# EAGLE design Turnout Decoder V1.2 (EAGLE 8.4.3)
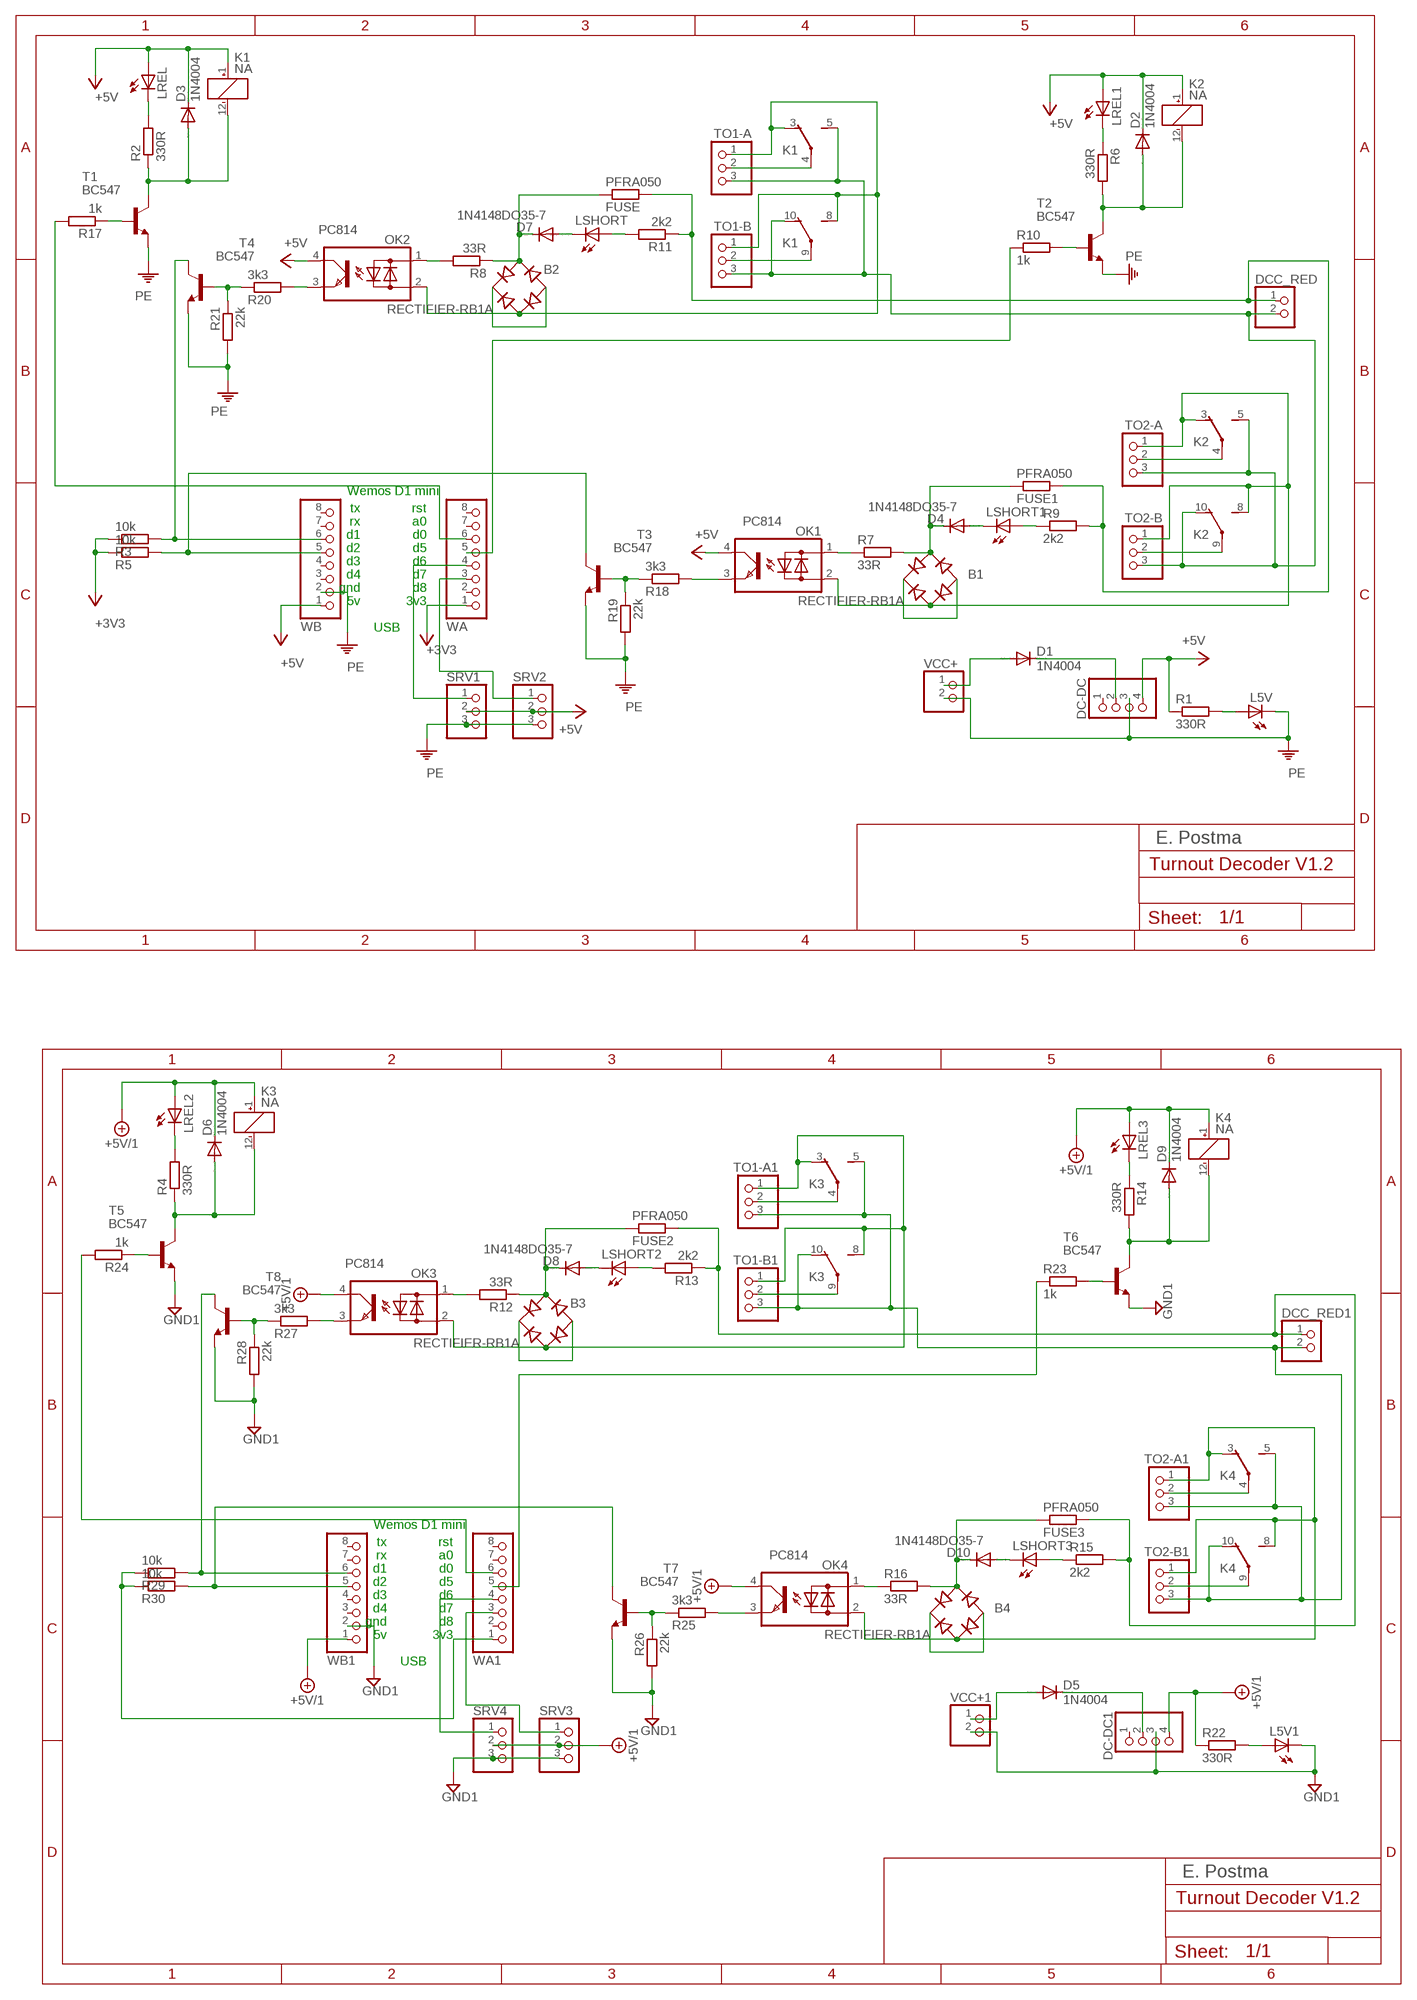
[diagram p0: schematic, sheet 1]

## Parts
B1  RECTIFIER-RB1A  [RB1A]
B2  RECTIFIER-RB1A  [RB1A]
B3  RECTIFIER-RB1A  [RB1A]
B4  RECTIFIER-RB1A  [RB1A]
D1  1N4004  [DO41-10]
D2  1N4004  [DO41-10]
D3  1N4004  [DO41-10]
D4  1N4148DO35-7  [DO35-7]
D5  1N4004  [DO41-10]
D6  1N4004  [DO41-10]
D7  1N4148DO35-7  [DO35-7]
D8  1N4148DO35-7  [DO35-7]
D9  1N4004  [DO41-10]
D10  1N4148DO35-7  [DO35-7]
DC-DC  PINHD-1X4  [1X04]
DC-DC1  PINHD-1X4  [1X04]
DCC_RED  PINHD-1X2  [1X02]
DCC_RED1  PINHD-1X2  [1X02]
FUSE  PFRA050  R-EU_0414/5V  [0414V]
FUSE1  PFRA050  R-EU_0414/5V  [0414V]
FUSE2  PFRA050  R-EU_0414/5V  [0414V]
FUSE3  PFRA050  R-EU_0414/5V  [0414V]
K1  NA  [NA]
K2  NA  [NA]
K3  NA  [NA]
K4  NA  [NA]
L5V  LED3MM  [LED3MM]
L5V1  LED3MM  [LED3MM]
LREL  LED3MM  [LED3MM]
LREL1  LED3MM  [LED3MM]
LREL2  LED3MM  [LED3MM]
LREL3  LED3MM  [LED3MM]
LSHORT  LED3MM  [LED3MM]
LSHORT1  LED3MM  [LED3MM]
LSHORT2  LED3MM  [LED3MM]
LSHORT3  LED3MM  [LED3MM]
OK1  PC814  [DIL04]
OK2  PC814  [DIL04]
OK3  PC814  [DIL04]
OK4  PC814  [DIL04]
R1  330R  R-EU_0207/7  [0207/7]
R2  330R  R-EU_0207/7  [0207/7]
R3  10k  R-EU_0207/7  [0207/7]
R4  330R  R-EU_0207/7  [0207/7]
R5  10k  R-EU_0207/7  [0207/7]
R6  330R  R-EU_0207/7  [0207/7]
R7  33R  R-EU_0207/7  [0207/7]
R8  33R  R-EU_0207/7  [0207/7]
R9  2k2  R-EU_0207/7  [0207/7]
R10  1k  R-EU_0207/7  [0207/7]
R11  2k2  R-EU_0207/7  [0207/7]
R12  33R  R-EU_0207/7  [0207/7]
R13  2k2  R-EU_0207/7  [0207/7]
R14  330R  R-EU_0207/7  [0207/7]
R15  2k2  R-EU_0207/7  [0207/7]
R16  33R  R-EU_0207/7  [0207/7]
R17  1k  R-EU_0207/7  [0207/7]
R18  3k3  R-EU_0207/7  [0207/7]
R19  22k  R-EU_0207/7  [0207/7]
R20  3k3  R-EU_0207/7  [0207/7]
R21  22k  R-EU_0207/7  [0207/7]
R22  330R  R-EU_0207/7  [0207/7]
R23  1k  R-EU_0207/7  [0207/7]
R24  1k  R-EU_0207/7  [0207/7]
R25  3k3  R-EU_0207/7  [0207/7]
R26  22k  R-EU_0207/7  [0207/7]
R27  3k3  R-EU_0207/7  [0207/7]
R28  22k  R-EU_0207/7  [0207/7]
R29  10k  R-EU_0207/7  [0207/7]
R30  10k  R-EU_0207/7  [0207/7]
SRV1  PINHD-1X3  [1X03]
SRV2  PINHD-1X3  [1X03]
SRV3  PINHD-1X3  [1X03]
SRV4  PINHD-1X3  [1X03]
T1  BC547  [TO92]
T2  BC547  [TO92]
T3  BC547  [TO92]
T4  BC547  [TO92]
T5  BC547  [TO92]
T6  BC547  [TO92]
T7  BC547  [TO92]
T8  BC547  [TO92]
TO1-A  PINHD-1X3  [1X03]
TO1-A1  PINHD-1X3  [1X03]
TO1-B  PINHD-1X3  [1X03]
TO1-B1  PINHD-1X3  [1X03]
TO2-A  PINHD-1X3  [1X03]
TO2-A1  PINHD-1X3  [1X03]
TO2-B  PINHD-1X3  [1X03]
TO2-B1  PINHD-1X3  [1X03]
VCC+  PINHD-1X2  [1X02]
VCC+1  PINHD-1X2  [1X02]
WA  PINHD-1X8  [1X08]
WA1  PINHD-1X8  [1X08]
WB  PINHD-1X8  [1X08]
WB1  PINHD-1X8  [1X08]

## Nets
+3V3 [3.3V]: R3.1 R5.1 WA.1
+5V [5V]: D2.C D3.C DC-DC.4 K1.1(1:+) K2.1(1:+) LREL1.A LREL.A OK1.4(C) OK2.4(C) R1.1 SRV1.2 SRV2.2 WB.1
+5V/1 [5V]: D6.C D9.C DC-DC1.4 K3.1(1:+) K4.1(1:+) LREL2.A LREL3.A OK3.4(C) OK4.4(C) R22.1 SRV3.2 SRV4.2 WB1.1
GND1 [Gnd]: DC-DC1.3 L5V1.K(C) R26.2 R28.2 SRV3.3 SRV4.3 T5.1(E) T6.1(E) T7.1(E) T8.1(E) VCC+1.2 WB1.2
N$1: LREL2.K(C) R4.2
N$2: LREL1.K(C) R6.1
N$3 [Rijstroom+]: DCC_RED.1 FUSE1.2 FUSE.2 R9.2 R11.1
N$4 [5V]: D1.A VCC+.1
N$5: OK1.1(AC1) R7.1
N$6: LSHORT1.A R9.1
N$7: D4.A LSHORT1.K(C)
N$8: D2.A K2.12(1:-) R6.2 T2.3(C)
N$9: R10.2 T2.2(B)
N$10 [Rijstroom+]: B1.+ B1.-
N$11: OK1.3(E) R18.2
N$12: LREL.K(C) R2.2
N$13 [Rijstroom+]: K2.4(2:P) TO2-A.2
N$14 [Rijstroom+]: B2.AC2 K1.3(2:O) K1.8(3:S) OK2.2(AC2) TO1-A.1 TO1-B.1
N$15 [Rijstroom-]: K2.9(3:P) TO2-B.2
N$16 [Rijstroom-]: DCC_RED.2 K1.5(2:S) K1.10(3:O) K2.5(2:S) K2.10(3:O) TO1-A.3 TO1-B.3 TO2-A.3 TO2-B.3
N$17: OK2.3(E) R20.2
N$18 [Rijstroom+]: B1.AC2 K2.3(2:O) K2.8(3:S) OK1.2(AC2) TO2-A.1 TO2-B.1
N$19: R3.2 T4.3(C) WB.6
N$20 [Rijstroom+]: B1.AC1 D4.C FUSE1.1 R7.2
N$21: OK2.1(AC1) R8.2
N$22: R5.2 T3.3(C) WB.5
N$23 [Rijstroom+]: B2.AC1 D7.C FUSE.1 R8.1
N$24: OK3.1(AC1) R12.2
N$25: LSHORT2.A R13.2
N$26 [Rijstroom+]: K1.4(2:P) TO1-A.2
N$27: R18.1 R19.1 T3.2(B)
N$28: R20.1 R21.1 T4.2(B)
N$29: R17.2 WA.6
N$30: D8.A LSHORT2.K(C)
N$31: SRV1.1 WA.4
N$32 [Rijstroom-]: K1.9(3:P) TO1-B.2
N$33: SRV2.1 WA.3
N$34: R10.1 WA.5
N$35: LSHORT.A R11.2
N$36: D6.A K3.12(1:-) R4.1 T5.3(C)
N$37: R24.1 T5.2(B)
N$38 [Rijstroom+]: B3.+ B3.-
N$39: L5V1.A R22.2
N$40 [5V]: D5.A VCC+1.1
N$41: D7.A LSHORT.K(C)
N$42 [Rijstroom+]: B2.+ B2.-
N$43 [5V]: D5.C DC-DC1.2
N$44 [Rijstroom+]: K3.4(2:P) TO1-A1.2
N$45 [Rijstroom-]: K3.9(3:P) TO1-B1.2
N$46: L5V.A R1.2
N$47 [Rijstroom+]: B3.AC2 K3.3(2:O) K3.8(3:S) OK3.2(AC2) TO1-A1.1 TO1-B1.1
N$48 [Rijstroom+]: B3.AC1 D8.C FUSE2.1 R12.1
N$49: R17.1 T1.2(B)
N$50: D3.A K1.12(1:-) R2.1 T1.3(C)
N$51: LREL3.K(C) R14.1
N$52: OK4.1(AC1) R16.1
N$53: LSHORT3.A R15.1
N$54: D10.A LSHORT3.K(C)
N$55: D9.A K4.12(1:-) R14.2 T6.3(C)
N$56: R23.2 T6.2(B)
N$57 [Rijstroom+]: B4.+ B4.-
N$58 [5V]: D1.C DC-DC.2
N$59 [Rijstroom+]: K4.4(2:P) TO2-A1.2
N$60 [Rijstroom-]: K4.9(3:P) TO2-B1.2
N$61 [Rijstroom-]: DCC_RED1.2 K3.5(2:S) K3.10(3:O) K4.5(2:S) K4.10(3:O) TO1-A1.3 TO1-B1.3 TO2-A1.3 TO2-B1.3
N$62 [Rijstroom+]: B4.AC2 K4.3(2:O) K4.8(3:S) OK4.2(AC2) TO2-A1.1 TO2-B1.1
N$63 [Rijstroom+]: B4.AC1 D10.C FUSE3.1 R16.2
N$64 [Rijstroom+]: DCC_RED1.1 FUSE2.2 FUSE3.2 R13.1 R15.2
N$65: SRV3.1 WA1.3
N$66: R23.1 WA1.5
N$67: SRV4.1 WA1.4
N$68: R25.1 R26.1 T7.2(B)
N$69: R27.1 R28.1 T8.2(B)
N$70: R24.2 WA1.6
N$71: R29.2 T8.3(C) WB1.6
N$72: OK3.3(E) R27.2
N$73: OK4.3(E) R25.2
N$74: R30.2 T7.3(C) WB1.5
N$76 [3.3V]: R29.1 R30.1 WA1.1
PE [Gnd]: DC-DC.3 L5V.K(C) R19.2 R21.2 SRV1.3 SRV2.3 T1.1(E) T2.1(E) T3.1(E) T4.1(E) VCC+.2 WB.2
Unconnected: DC-DC1.1 DC-DC.1 WA1.2 WA1.7 WA1.8 WA.2 WA.7 WA.8 WB1.3 WB1.4 WB1.7 WB1.8 WB.3 WB.4 WB.7 WB.8

## Notes on the sheet
- Wemos D1 mini
- tx | rst
- rx | a0
- d1 | d0
- d2 | d5
- d3 | d6
- d4 | d7
- gnd | d8
- 5v | 3v3
- USB
- E. Postma
- Wemos D1 mini
- tx | rst
- rx | a0
- d1 | d0
- d2 | d5
- d3 | d6
- d4 | d7
- gnd | d8
- 5v | 3v3
- USB
- E. Postma

## Library data of the parts
B1-B4 = rectifier:RECTIFIER-: Rectifier
D1-D3 D5 D6 D9 = diode:1N4004: DIODE general purpose rectifier, 1 A
D4 D7 D8 D10 = diode:1N4148: DIODE high speed (Philips)
DC-DC DC-DC1 = pinhead:PINHD-1X4: PIN HEADER
DCC_RED DCC_RED1 VCC+ VCC+1 = pinhead:PINHD-1X2: PIN HEADER
FUSE FUSE1-FUSE3 R1-R30 = resistor:R-EU_: RESISTOR, European symbol
K1-K4 = relay:NA: RELAY; OC_FARNELL: unknown; OC_NEWARK: unknown
L5V L5V1 LREL LREL1-LREL3 LSHORT LSHORT1-LSHORT3 = led:LED: LED OSRAM: - CHIPLED LG R971, LG N971, LY N971, LG Q971, LY Q971, LO R971, LY R971 LH N974, LH R974 LS Q976, LO Q976, LY Q976 LO Q996 - Hyper CHIPLED LW Q18S LB Q993, LB Q99A, LB R99A - SideLED LS A670, LO A670, LY A670, LG A670, LP A670 LB A673, LV A673, LT A673, LW A673 LH A674 LY A675 LS A676, LA A676, LO A676, LY A676, LW A676 LS A679, LY A679, LG A679 - Hyper Micro SIDELED® LS Y876, LA Y876, LO Y876, LY Y876 LT Y87S - SmartLED LW L88C, LW L88S LB L89C, LB L89S, LG L890 LS L89K, LO L89K, LY L89K LS L896, LA L896, LO L896, LY L896 - TOPLED LS T670, LO T670, LY T670, LG T670, LP T670 LSG T670, LSP T670, LSY T670, LOP T670, LYG T670 LG T671, LOG T671, LSG T671 LB T673, LV T673, LT T673, LW T673 LH T674 LS T676, LA T676, LO T676, LY T676, LB T676, LH T676, LSB T676, LW T676 LB T67C, LV T67C, LT T67C, LS T67K, LO T67K, LY T67K, LW E67C LS E67B, LA E67B, LO E67B, LY E67B, LB E67C, LV E67C, LT E67C LW T67C LS T679, LY T679, LG T679 LS T770, LO T770, LY T770, LG T770, LP T770 LB T773, LV T773, LT T773, LW T773 LH T774 LS E675, LA E675, LY E675, LS T675 LS T776, LA T776, LO T776, LY T776, LB T776 LHGB T686 LT T68C, LB T68C - Hyper Mini TOPLED® LB M676 - Mini TOPLED Santana® LG M470 LS M47K, LO M47K, LY M47K Source: http://www.osram.convergy.de LUXEON: - LUMILED® LXK2-PW12-R00, LXK2-PW12-S00, LXK2-PW14-U00, LXK2-PW14-V00 LXK2-PM12-R00, LXK2-PM12-S00, LXK2-PM14-U00 LXK2-PE12-Q00, LXK2-PE12-R00, LXK2-PE12-S00, LXK2-PE14-T00, LXK2-PE14-U00 LXK2-PB12-K00, LXK2-PB12-L00, LXK2-PB12-M00, LXK2-PB14-N00, LXK2-PB14-P00, LXK2-PB14-Q00 LXK2-PR12-L00, LXK2-PR12-M00, LXK2-PR14-Q00, LXK2-PR14-R00 LXK2-PD12-Q00, LXK2-PD12-R00, LXK2-PD12-S00 LXK2-PH12-R00, LXK2-PH12-S00 LXK2-PL12-P00, LXK2-PL12-Q00, LXK2-PL12-R00 Source: www.luxeon.com KINGBRIGHT: KA-3528ASYC Source: www.kingbright.com
OK1-OK4 = optocoupler:PC814: SHARP OPTO COUPLER; OC_FARNELL: 9707662; OC_NEWARK: unknown
SRV1-SRV4 TO1-A TO1-A1 TO1-B TO1-B1 TO2-A TO2-A1 TO2-B TO2-B1 = pinhead:PINHD-1X3: PIN HEADER
T1-T8 = transistor:BC547: NPN TRANSISTOR
WA WA1 WB WB1 = pinhead:PINHD-1X8: PIN HEADER

## Net classes
0 default: width 0.508 mm, clearance 0.254 mm
1 5V: width 0.762 mm, clearance 0.254 mm
2 Gnd: width 0.762 mm, clearance 0.254 mm
3 Extra: width 1.016 mm, clearance 0.254 mm
4 Rijstroom+: width 1.016 mm, clearance 0.254 mm
5 3.3V: width 0.508 mm, clearance 0.254 mm
6 Rijstroom-: width 1.016 mm, clearance 0.254 mm

## Board
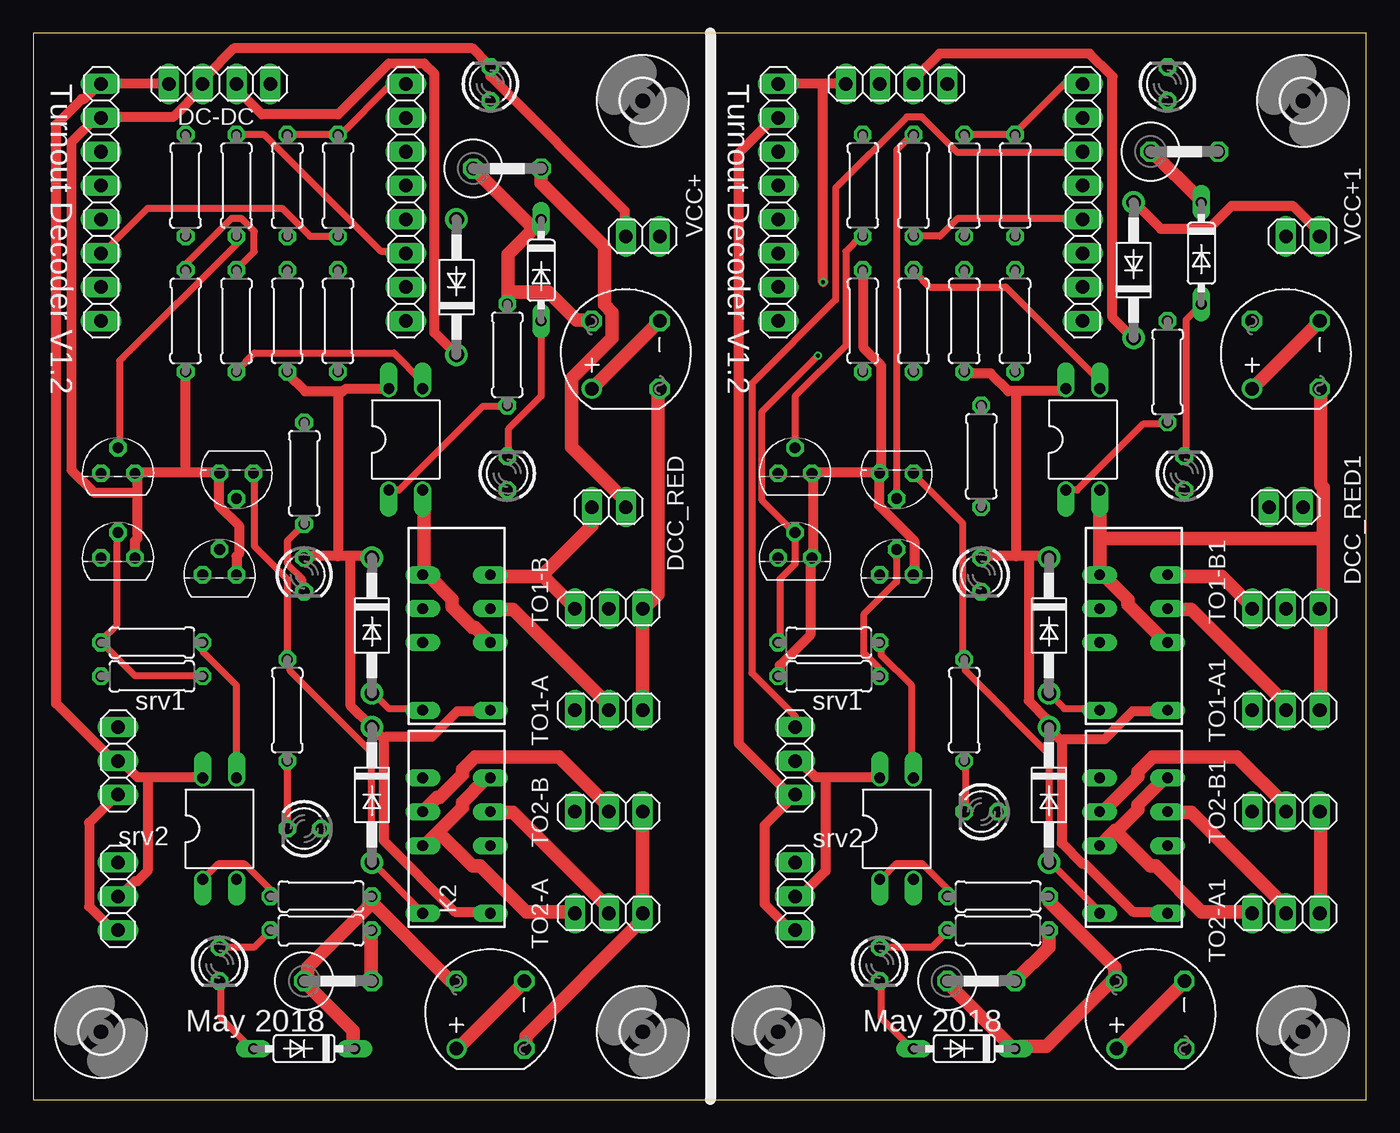
[diagram p1: board, top side]
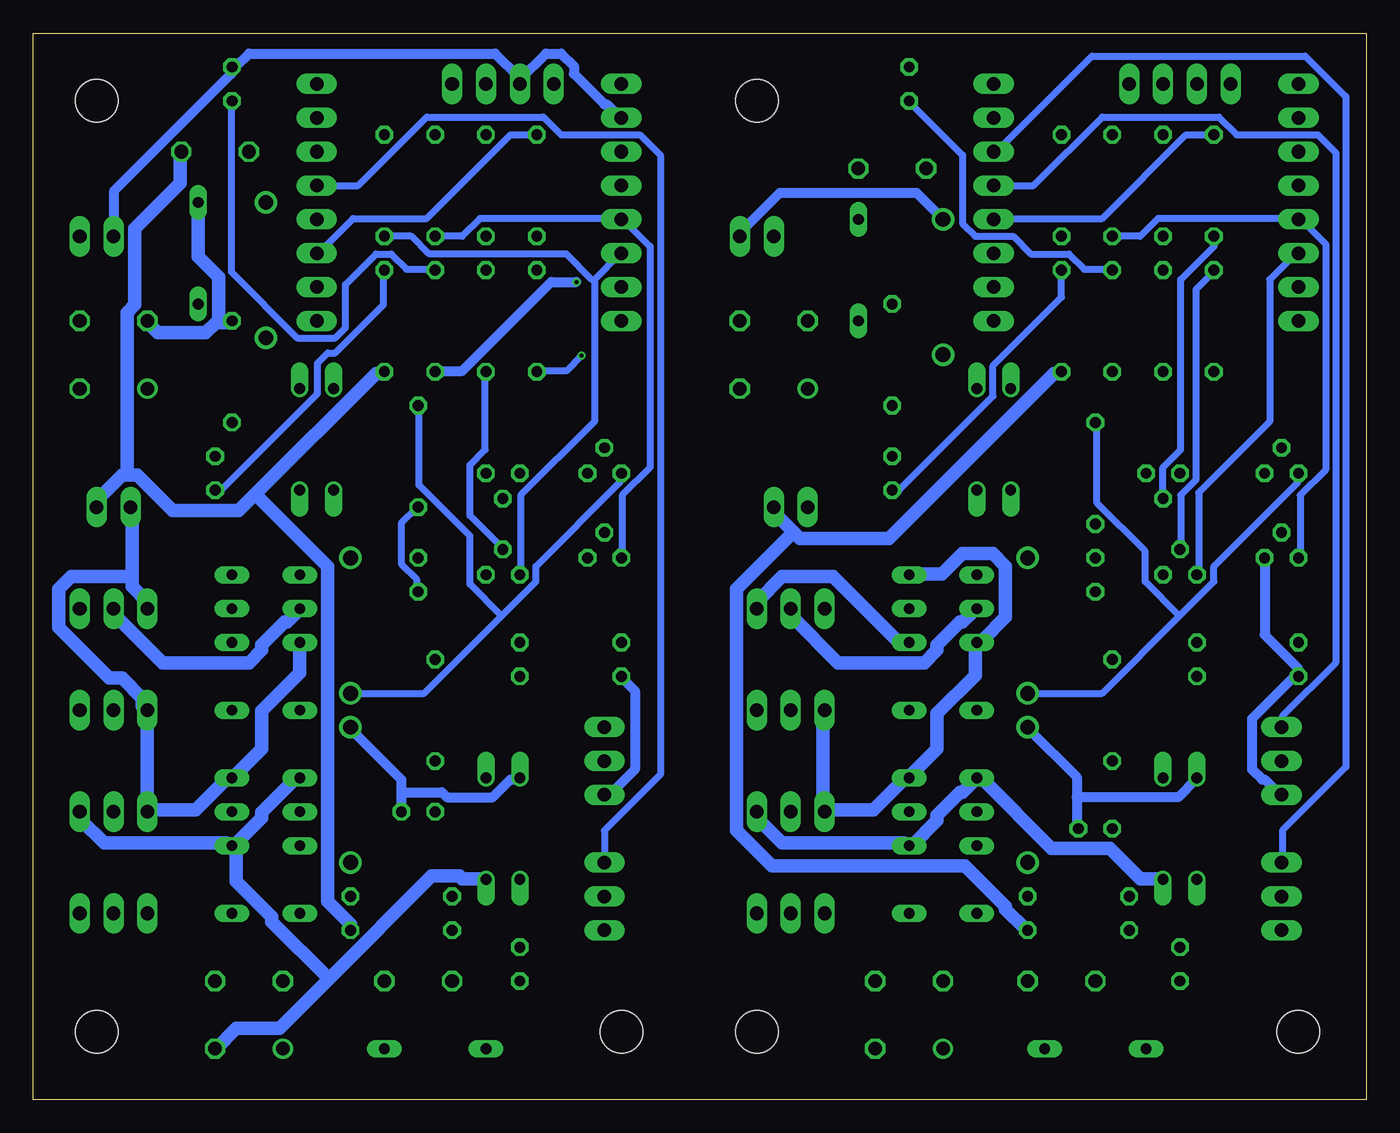
[diagram p2: board, bottom side, seen from below]

Size 100 x 80 mm. Coordinates in mm from the lower left corner, seen from the top.
Outline: 0,0 100,0 100,80 0,80 0,0
Copper layers (1*16): Top 0.035mm / dielectric 1.5mm / Bottom 0.035mm
Design rules "NOA Eagle Rule 2016-06-12": minimum track width 6mil, minimum drill 0.3mm, track to track 6mil, track to pad 6mil, pad to pad 6mil, via to via 6mil, smd to smd 0mil, copper to edge 0.4mm, drill to drill 10mil, minimum pad ring 10mil, minimum via ring 6mil, stop-mask expansion 2mil, vias tented up to drill 25mil, thermal gap 10mil
tRestrict: 2 lines
bRestrict: 2 lines

### Footprints (pad centres in the part's own frame; a part is rotated, then mirrored left to right if it is on the bottom)
RB1A = drill 1.016: + -2.54,2.54 | drill 1.016 octagon: - 2.54,-2.54; AC1 2.54,2.54; AC2 -2.54,-2.54
DO41-10 = drill 1.118: A 5.08,0; C -5.08,0
DO35-7 = drill 0.813 long: A 3.81,0; C -3.81,0
1X04 = drill 1.016 long: 1 -3.81,0; 2 -1.27,0; 3 1.27,0; 4 3.81,0
1X02 = drill 1.016 long: 1 -1.27,0; 2 1.27,0
0414V = drill 1.016 octagon: 1 -2.54,0; 2 2.54,0
NA = drill 0.8 long: 1 -6.35,-2.54; 3 -1.27,-2.54; 4 1.27,-2.54; 5 3.81,-2.54; 8 3.81,2.54; 9 1.27,2.54; 10 -1.27,2.54; 12 -6.35,2.54
LED3MM = drill 0.813 octagon: A -1.27,0; K 1.27,0
DIL04 = drill 0.813 offset: 1 -1.27,-3.81; 2 1.27,-3.81; 3 1.27,3.81; 4 -1.27,3.81
0207/7 = drill 0.813 octagon: 1 -3.81,0; 2 3.81,0
1X03 = drill 1.016 long: 1 -2.54,0; 2 0,0; 3 2.54,0
TO92 = drill 0.813 octagon: 1 1.27,0; 2 0,1.905; 3 -1.27,0
3,2 = hole 3.2: 0,0
1X08 = drill 1.016 long: 1 -8.89,0; 2 -6.35,0; 3 -3.81,0; 4 -1.27,0; 5 1.27,0; 6 3.81,0; 7 6.35,0; 8 8.89,0

### Placement (x,y rotation side)
B1  34.29,6.35 90 top
B2  44.45,55.88 90 top
B3  93.98,55.88 90 top
B4  83.82,6.35 90 top
D1  31.75,60.96 90 top
D2  25.4,22.86 270 top
D3  25.4,35.56 270 top
D4  20.32,3.81 180 top
D5  82.55,62.23 90 top
D6  76.2,35.56 270 top
D7  38.1,62.23 270 top
D8  87.63,63.5 270 top
D9  76.2,22.86 270 top
D10  69.85,3.81 180 top
DC-DC  13.97,76.2 180 top
DC-DC1  64.77,76.2 180 top
DCC_RED  43.18,44.45 180 top
DCC_RED1  93.98,44.45 180 top
FUSE  35.56,69.85 0 top
FUSE1  22.86,8.89 0 top
FUSE2  86.36,71.12 0 top
FUSE3  71.12,8.89 0 top
K1  31.75,35.56 90 top
K2  31.75,20.32 90 top
K3  82.55,35.56 90 top
K4  82.55,20.32 90 top
L5V  34.29,76.2 90 top
L5V1  85.09,76.2 90 top
LREL  20.32,39.37 270 top
LREL1  20.32,20.32 180 top
LREL2  71.12,39.37 270 top
LREL3  71.12,21.59 180 top
LSHORT  35.56,46.99 90 top
LSHORT1  13.97,10.16 270 top
LSHORT2  86.36,46.99 90 top
LSHORT3  63.5,10.16 270 top
OK1  13.97,20.32 0 top
OK2  27.94,49.53 0 top
OK3  78.74,49.53 0 top
OK4  64.77,20.32 0 top
R1  19.05,58.42 90 top
R2  20.32,46.99 270 top
R3  22.86,68.58 270 top
R4  71.12,48.26 270 top
R5  19.05,68.58 270 top
R6  19.05,29.21 90 top
R7  21.59,15.24 0 top
R8  35.56,55.88 270 top
R9  21.59,12.7 0 top
R10  11.43,68.58 270 top
R11  22.86,58.42 90 top
R12  85.09,54.61 270 top
R13  73.66,58.42 90 top
R14  69.85,29.21 90 top
R15  72.39,12.7 0 top
R16  72.39,15.24 0 top
R17  15.24,68.58 90 top
R18  8.89,34.29 0 top
R19  8.89,31.75 180 top
R20  15.24,58.42 270 top
R21  11.43,58.42 270 top
R22  69.85,58.42 90 top
R23  66.04,68.58 90 top
R24  62.23,68.58 90 top
R25  59.69,34.29 0 top
R26  62.23,58.42 90 top
R27  66.04,58.42 90 top
R28  59.69,31.75 180 top
R29  73.66,68.58 270 top
R30  69.85,68.58 270 top
SRV1  6.35,25.4 270 top
SRV2  6.35,15.24 270 top
SRV3  57.15,25.4 270 top
SRV4  57.15,15.24 270 top
T1  6.35,46.99 0 top
T2  15.24,46.99 180 top
T3  6.35,40.64 0 top
T4  13.97,39.37 0 top
T5  57.15,46.99 0 top
T6  64.77,46.99 180 top
T7  57.15,40.64 0 top
T8  64.77,39.37 0 top
TO1-A  43.18,29.21 180 top
TO1-A1  93.98,29.21 180 top
TO1-B  43.18,36.83 180 top
TO1-B1  93.98,36.83 180 top
TO2-A  43.18,13.97 180 top
TO2-A1  93.98,13.97 180 top
TO2-B  43.18,21.59 180 top
TO2-B1  93.98,21.59 180 top
U$1  [3,2]  45.72,74.93 270 top
U$2  [3,2]  45.72,5.08 270 top
U$3  [3,2]  55.88,5.08 270 top
U$4  [3,2]  5.08,5.08 270 top
U$5  [3,2]  95.25,5.08 270 top
U$6  [3,2]  95.25,74.93 270 top
VCC+  45.72,64.77 180 top
VCC+1  95.25,64.77 180 top
WA  27.94,67.31 270 top
WA1  78.74,67.31 270 top
WB  5.08,67.31 270 top
WB1  55.88,67.31 270 top

### Tracks (layer width: path | path; a pad name or v marks a point on that pad's centre or on a via)
+3V3
  Top 0.508: R5.1 R3.1 23.05,72.39 26.86,76.2 WA.1
+5V
  Top 0.762: 23.81,40.77 25.34,40.77 D3.C | 23.81,40.77 22.86,40.77 | 22.86,40.77 20.38,40.77 LREL.A | OK2.4 23.43,53.34 23.24,53.15 22.86,53.15 | 22.86,53.15 20.38,53.15 19.05,54.48 R1.1 | 22.86,53.15 22.86,40.77 | 26.29,27.05 26.29,19.43 31.62,14.1 34.29,14.1 K2.1 | 26.29,27.05 D2.C 23.81,29.53 23.81,40.77 | K1.1 34.29,29.15 31.81,29.15 29.91,27.24 26.48,27.24 26.29,27.05 | DC-DC.4 WB.1 4.76,76.01 3.81,75.06 3.62,75.06 1.71,73.15 1.71,29.72 6.1,25.34 SRV1.2 6.48,25.53 7.81,24.19 8.57,24.19 | 8.57,24.19 12.57,24.19 OK1.4 | 8.57,24.19 8.57,17.14 7.81,16.38 7.62,16.38 6.48,15.24 SRV2.2
  Bottom 0.762: 21.72,22.67 21.72,24.19 25.34,27.81 D2.C | 21.72,22.67 21.72,20.38 LREL1.A | 21.72,22.67 14.1,22.67 12.76,24 OK1.4
+5V/1  (via drill 0.3)
  Top 0.762: 59.44,24.19 58.67,24.19 57.53,25.34 57.15,25.34 SRV3.2 | 59.44,24.19 63.44,24.19 OK4.4 | SRV4.2 57.53,15.24 59.44,17.14 59.44,24.19 | 77.15,26.86 77.15,19.24 78.68,17.72 78.87,17.72 82.49,14.1 84.96,14.1 K4.1 | 77.15,26.86 76.2,27.81 D9.C 76.01,28.19 76.01,28.57 74.68,29.91 74.68,40.77 | K3.1 84.96,29.15 82.49,29.15 80.39,27.05 77.34,27.05 77.15,26.86 | 74.68,40.77 76.2,40.77 D6.C | 74.68,40.77 73.72,40.77 | 73.72,40.77 71.25,40.77 LREL2.A | DC-DC1.4 59.24,76.2 | 59.24,76.2 WB1.1 | 73.72,53.15 77.15,53.15 77.34,53.34 OK3.4 | 73.72,53.15 73.15,53.15 71.82,54.48 69.91,54.48 R22.1 | v59.24,61.34 59.24,76.2 | 73.72,53.15 73.72,40.77
  Bottom 0.762: 72.39,23.05 72.39,24 76.2,27.81 D9.C | 72.39,23.05 LREL3.A | 72.39,23.05 69.34,23.05 68.96,22.67 65.53,22.67 64.2,24 63.63,24 OK4.4 | v59.24,61.34 61.15,61.34 67.82,54.67 69.72,54.67 R22.1
GND1
  Top 0.762: SRV4.3 57.15,12.76 56.77,12.76 54.86,14.67 54.86,20.57 SRV3.3 56.77,22.86 52.96,26.67 52.96,71.06 55.44,73.53 55.82,73.53 WB1.2 | R28.2 56.01,31.81 56.01,32.58 58.29,34.86 58.29,40.58 T7.1 58.48,40.96 58.48,46.67 T5.1 58.48,47.05 63.44,47.05 T6.1 | R26.2 62.29,62.1 62.29,56.39 63.63,55.05 63.63,47.24 T6.1 | T8.1 66.1,39.43 66.1,41.91 63.44,44.58 63.44,46.67 T6.1
  Bottom 0.762: WB1.2 56.01,73.72 56.96,74.68 57.15,74.68 59.44,76.96 59.44,77.53 60.39,78.49 61.53,78.49 63.44,76.58 63.44,76.2 DC-DC1.3 63.63,76.77 65.34,78.49 83.82,78.49 84.77,77.53 L5V1.K 85.15,77.34 85.15,76.96 93.92,68.2 93.92,64.77 VCC+1.2 | SRV3.3 56.77,22.86 54.86,24.77 54.86,30.67 55.82,31.62 R28.2
N$1
  Bottom 0.508: LREL2.K 71.25,38.1 71.25,39.05 72.39,40.2 72.39,43.24 71.25,44.39 R4.2
N$2
  Top 0.508: R6.1 LREL1.K
N$3
  Top 1.016: R9.2 25.34,12.57 25.34,8.95 FUSE1.2 | FUSE.2 38.1,68.77 42.86,64.01 42.86,59.63 43.43,59.05 43.43,57.15 40.39,54.1 40.39,48.96 44.39,44.96 44.39,44.58 DCC_RED.1
  Bottom 1.016: 42.96,42.58 44.39,44.01 44.39,44.39 DCC_RED.1 | 42.96,42.58 42.48,42.1 35.81,42.1 23.43,54.48 22.86,54.48 R11.1 | 42.96,42.58 47.24,38.29 47.24,20.19 44.58,17.53 30.1,17.53 27.05,14.48 27.05,14.29 25.53,12.76 R9.2
N$4
  Bottom 0.762: D1.A 33.72,68.01 44.01,68.01 46.86,65.15 46.86,64.77 VCC+.1
N$5
  Top 0.508: OK1.1 13.91,17.72 15.81,17.72 17.72,15.81 17.72,15.24 R7.1
N$6
  Top 0.508: LSHORT1.A 16.57,11.43 17.72,12.57 R9.1
N$7
  Top 0.508: LSHORT1.K 14.1,8.76 14.1,6.1 16.38,3.81 D4.A
N$8
  Top 0.508: K2.12 29.15,14.1 25.53,17.72 D2.A 25.34,17.91 25.34,26.1 19.24,32.19 19.24,32.96 R6.2 19.05,39.05 16.57,41.53 16.57,46.86 T2.3
N$9
  Bottom 0.508: R10.2 11.43,64.01 13.91,61.53 13.91,48.77 15.24,47.43 T2.2
N$10
  Top 1.016: B1.+ 31.81,3.81 36.77,8.76 B1.-
N$11
  Top 0.508: OK1.3 15.24,31.05 12.76,33.53 12.76,34.29 R18.2
N$12
  Top 0.508: R2.2 19.05,41.91 19.05,40.2 20.19,39.05 20.19,38.1 LREL.K
N$13
  Top 1.016: K2.4 34.29,21.53 36.01,21.53 43.05,14.48 43.05,14.1 TO2-A.2
N$14
  Top 1.016: OK2.2 29.34,45.72 29.34,39.43 K1.8 29.72,39.24 31.43,37.53 31.43,36.96 32.96,35.43 33.15,35.43 K1.3 | TO1-A.1 TO1-B.1 46.1,37.15 46.86,37.91 46.86,53.34 B2.AC2
  Bottom 1.016: K1.3 35.05,34.29 40.01,39.24 43.81,39.24 45.72,37.34 TO1-B.1
N$15
  Top 1.016: K2.9 30.29,22.67 30.48,22.67 32.19,24.38 32.19,24.77 33.15,25.72 39.43,25.72 43.05,22.1 43.05,21.72 TO2-B.2
N$16
  Top 1.016: 38.29,39.24 34.29,39.24 K1.5 | 38.29,39.24 40.58,36.96 TO1-B.3 | DCC_RED.2 41.91,43.05 38.48,39.62 38.29,39.24 | 30.39,20.1 32.19,21.91 32.19,22.29 33.91,24 34.29,24 K2.5 | 30.39,20.1 29.34,19.05 K2.10 | 30.39,20.1 32.96,17.53 33.53,17.53 36.96,14.1 40.58,14.1 TO2-A.3
  Bottom 1.016: TO1-A.3 40.77,29.15 40.77,22.1 TO2-B.3 40.58,21.72 36.96,21.72 34.67,24 K2.5 34.29,24.19 32.19,26.29 32.19,28.96 29.34,31.81 29.34,34.29 K1.10 28.77,34.48 27.05,36.2 27.05,40.01 28,40.96 30.29,40.96 31.81,39.43 34.29,39.43 K1.5
N$17
  Top 0.508: OK2.3 29.15,53.34 29.15,53.91 27.05,56.01 16.57,56.01 15.24,54.67 R20.2
N$18
  Top 1.016: B1.AC2 36.96,3.81 36.96,4.76 45.72,13.53 TO2-A.1 TO2-B.1
  Bottom 1.016: OK1.2 15.24,16.57 16.95,16.57 19.24,18.86 23.62,18.86 28.77,24 K2.8 30.29,23.05 30.48,23.05 32.19,21.34 32.19,20.95 34.1,19.05 K2.3 34.67,19.24 43.81,19.24 45.72,21.14 TO2-B.1
N$19
  Top 0.508: R3.2 20.77,64.77 18.67,66.86 8.57,66.86 5.14,63.44 WB.6
  Bottom 0.508: T4.3 12.57,39.43 12.57,45.53 7.24,50.86 7.24,61.53 5.14,63.63 WB.6
N$20
  Top 1.016: D4.C 24,3.81 24,5.14 20.38,8.76 FUSE1.1 20.57,9.34 20.57,9.91 25.34,14.67 | 25.34,14.67 25.34,15.24 R7.2 | B1.AC1 31.62,8.95 31.24,8.95 25.72,14.48 25.34,14.67
N$21
  Top 0.508: OK2.1 27.43,45.72 33.72,52.01 35.43,52.01 R8.2
N$22
  Bottom 0.508: T3.3 4.95,40.77 4.95,45.34 3.05,47.24 3.05,64.2 4.95,66.1 WB.5 5.14,66.1 15.62,66.1 16.95,64.77 R5.2
N$23
  Top 1.016: 35.62,60.58 35.62,63.44 37.53,65.34 | 35.62,60.58 35.62,59.82 R8.1 | 37.53,65.34 38.1,65.91 D7.C | 35.62,60.58 38.67,60.58 40.77,58.48 41.91,58.48 B2.AC1 | 37.53,65.34 FUSE.1
N$24
  Top 0.508: OK3.1 78.3,45.72 83.25,50.67 84.96,50.67 R12.2
N$25
  Bottom 0.508: LSHORT2.A 85.92,45.72 78.68,52.96 78.68,55.24 77.92,56.01 77.34,56.01 73.72,59.63 73.72,62.1 R13.2
N$26
  Top 1.016: K1.4 34.29,36.77 36.01,36.77 43.05,29.72 43.05,29.34 TO1-A.2
N$27
  Top 0.508: R19.1 12.57,31.81 7.62,31.81 5.14,34.29 R18.1 5.14,34.48 6.29,35.62 6.29,42.48 T3.2
N$28
  Top 0.508: R21.1 11.43,62.67 14.86,66.1 15.62,66.1 16.57,65.15 16.57,63.63 15.24,62.29 R20.1
  Bottom 0.508: T4.2 13.91,41.34 13.91,45.34 12.76,46.48 12.76,60.77 11.43,62.1 R21.1
N$29
  Top 0.508: R17.2 17.34,72.39 26.1,63.63 27.81,63.63 WA.6
N$30
  Top 0.508: LSHORT2.K 86.49,48.39 86.49,58.48 87.63,59.63 D8.A
N$31
  Bottom 0.508: WA.4 24.96,68.58 19.81,73.72 11.05,73.72 9.72,72.39 3.62,72.39 2.29,71.06 2.29,32.77 6.29,28.77 6.29,28 SRV1.1
N$32
  Bottom 1.016: K1.9 29.34,36.77 30.29,35.81 30.48,35.81 32.19,34.1 32.19,33.72 33.15,32.77 39.62,32.77 43.05,36.2 43.05,36.77 TO1-B.2
N$33
  Bottom 0.508: SRV2.1 6.29,17.91 6.29,20.19 1.52,24.96 1.52,75.25 4.57,78.3 20.57,78.3 27.81,71.06 WA.3
N$34
  Bottom 0.508: R10.1 13.53,72.39 19.81,66.1 27.81,66.1 WA.5
N$35
  Bottom 0.508: R11.2 22.86,60.2 28,55.05 28,52.77 35.05,45.72 LSHORT.A
N$36
  Top 0.508: D6.A 77.34,29.34 80.01,29.34 K3.12
  Bottom 0.508: 64.86,36.29 70.67,30.48 D6.A | 64.86,36.29 62.29,38.86 62.29,40.01 56.01,46.29 56.01,46.86 T5.3 | 64.86,36.29 67.25,38.67 67.25,42.29 71.06,46.1 71.06,52.01 R4.1
N$37
  Top 0.508: T5.2 57.15,52.77 60.96,56.58 60.96,63.63 62.1,64.77 R24.1
N$38
  Top 1.016: B3.- B3.+
N$39
  Bottom 0.508: R22.2 69.91,62.29 72.01,62.29 73.15,63.44 74.3,63.44 76.58,61.15 76.58,57.91 77.34,57.15 80.2,57.15 85.15,62.1 85.15,74.87 L5V1.A
N$40
  Top 0.762: VCC+1.1 96.39,64.77 96.39,65.15 94.49,67.06 89.92,67.06 88.2,65.34 84.58,65.34 82.68,67.25 D5.A
N$41
  Top 0.508: D7.A 38.1,52.77 35.62,50.29 35.62,48.39 LSHORT.K
N$42
  Top 1.016: B2.- B2.+
N$43
  Top 0.762: DC-DC1.2 66.1,76.2 66.1,76.58 68.01,78.49 79.25,78.49 80.96,76.77 80.96,58.67 82.49,57.15 D5.C
N$44
  Top 1.016: K3.4 85.15,36.77 86.87,36.77 93.92,29.72 93.92,29.34 TO1-A1.2
N$45
  Bottom 1.016: K3.9 80.01,36.77 80.96,35.81 81.15,35.81 82.87,34.1 82.87,33.72 83.82,32.77 90.3,32.77 93.92,36.39 93.92,36.77 TO1-B1.2
N$46
  Bottom 0.508: R1.2 19.05,62.29 21.14,62.29 22.29,63.44 25.15,63.44 26.48,64.77 29.34,64.77 30.29,65.72 30.29,70.87 34.29,74.87 L5V.A
N$47
  Top 1.016: OK3.2 80.01,42.1 | 80.01,42.1 K3.8 80.39,39.24 82.11,37.53 82.11,37.15 84.96,34.29 K3.3 | TO1-A1.1 96.58,29.34 96.58,36.77 TO1-B1.1 96.77,37.15 96.77,42.1 | 96.77,42.1 96.77,45.91 96.58,46.1 96.58,53.34 B3.AC2 | 96.77,42.1 80.01,42.1
N$48
  Top 1.016: D8.C 87.63,67.44 83.82,71.25 FUSE2.1
  Bottom 1.016: 86.11,58.29 86.3,58.29 87.06,57.53 90.68,57.53 91.44,58.29 B3.AC1 | 86.11,58.29 85.15,58.29 R12.1 | 86.11,58.29 86.11,61.72 87.63,63.25 D8.C
N$49
  Top 0.508: R17.1 15.24,64.2 6.48,55.44 6.48,48.96 T1.2
N$50
  Top 0.508: K1.12 29.15,29.34 26.67,29.34 25.53,30.48 D3.A
  Bottom 0.508: 14,36.29 19.81,30.48 D3.A | 14,36.29 11.43,38.86 11.43,40.01 5.14,46.29 5.14,46.86 T1.3 | 14,36.29 16.57,38.86 16.57,41.15 20.19,44.77 20.19,50.67 R2.1
N$51
  Top 0.508: LREL3.K 69.91,21.72 69.91,25.34 R14.1
N$52
  Top 0.508: R16.1 68.58,15.81 66.67,17.72 64.77,17.72 63.63,16.57 OK4.1
N$53
  Top 0.508: LSHORT3.A 67.44,11.43 68.58,12.57 R15.1
N$54
  Top 0.508: LSHORT3.K 63.63,8.76 63.63,6.1 65.91,3.81 D10.A
N$55
  Top 0.508: K4.12 80.01,14.1 76.2,17.91 D9.A 76.2,25.91 69.91,32.19 69.91,32.96 R14.2 69.72,33.15 69.72,43.24 66.1,46.86 T6.3
N$56
  Top 0.508: T6.2 64.77,71.25 65.91,72.39 R23.2
N$57
  Top 1.016: B4.+ 81.34,3.81 86.3,8.76 B4.-
N$58
  Top 0.762: DC-DC.2 15.24,75.82 17.14,73.91 22.86,73.91 26.67,77.72 29.34,77.72 30.1,76.96 30.1,57.53 D1.C
N$59
  Top 1.016: K4.4 85.15,21.53 86.87,21.53 93.92,14.48 93.92,14.1 TO2-A1.2
N$60
  Top 1.016: K4.9 80.01,21.72 80.39,21.72 82.87,24.19 82.87,24.57 84.01,25.72 90.3,25.72 93.92,22.1 93.92,21.72 TO2-B1.2
N$61
  Top 1.016: K3.5 85.15,39.24 89.15,39.24 91.44,36.96 TO1-B1.3 | K4.10 81.15,20.19 81.34,20.19 | 81.34,20.19 82.87,21.72 82.87,22.1 84.96,24.19 K4.5 | TO2-A1.3 91.44,14.1 87.63,14.1 84.2,17.53 83.82,17.53 81.53,19.81 81.34,20.19
  Bottom 1.016: 92.58,39.24 92.58,38.48 91.44,37.34 TO1-B1.3 | 92.58,39.24 92.58,44.39 DCC_RED1.2 | K3.10 80.01,32 82.87,29.15 82.87,26.29 84.96,24.19 K4.5 85.53,24 87.82,21.72 91.44,21.72 TO2-B1.3 TO1-A1.3 91.82,29.53 91.82,30.1 93.34,31.62 94.3,31.62 98.11,35.43 98.11,38.29 97.16,39.24 92.58,39.24
N$62
  Top 1.016: TO2-A1.1 96.58,14.1 96.58,21.53 TO2-B1.1
  Bottom 1.016: K4.8 80.01,24 80.39,24 82.87,21.53 82.87,21.14 84.96,19.05 K4.3 | TO2-B1.1 96.39,21.53 96.39,20.95 94.68,19.24 85.53,19.24 K4.3 | 77.82,9.05 81.53,5.33 84.77,5.33 86.3,3.81 B4.AC2 | 77.82,9.05 70.1,16.76 68.01,16.76 67.82,16.57 66.1,16.57 OK4.2 | 77.82,9.05 82.11,13.34 82.11,13.72 84.77,16.38 84.77,18.67 K4.3
N$63
  Top 1.016: FUSE3.1 68.58,8.76 73.53,3.81 D10.C 74.11,4 76.01,4 80.77,8.76 B4.AC1 81.15,8.95 81.15,9.91 76.2,14.86 R16.2
N$64
  Top 1.016: R15.2 76.2,11.43 FUSE3.2
  Bottom 1.016: 83.34,45.43 84.58,44.2 89.53,44.2 92.2,46.86 92.96,46.86 | 83.34,45.43 74.3,54.48 73.72,54.48 R13.1 | 92.96,46.86 93.34,46.86 95.25,44.96 DCC_RED1.1 | 92.96,46.86 92.96,59.05 92.39,59.63 92.39,65.34 88.96,68.77 88.96,71.06 FUSE2.2 | R15.2 76.2,13.14 77.92,14.86 77.92,40.01 83.34,45.43
N$65
  Top 0.508: SRV3.1 57.15,28.77 53.91,32 53.91,53.72 60.2,60.01 60.2,68.39 65.53,73.72 66.67,73.72 69.34,71.06 78.68,71.06 WA1.3
N$66
  Top 0.508: R23.1 68.01,64.77 69.34,66.1 78.68,66.1 WA1.5
N$67
  Bottom 0.508: SRV4.1 57.15,20.19 52.96,24.38 52.96,70.87 54.48,72.39 60.39,72.39 61.72,73.72 70.48,73.72 75.63,68.58 WA1.4
N$68  (via drill 0.3)
  Top 0.508: R25.1 56.01,34.29 56.01,39.05 57.15,40.2 T7.2 56.96,42.67 54.67,44.96 54.67,51.63 v58.86,55.82
  Bottom 0.508: v58.86,55.82 60.01,54.67 62.1,54.67 R26.1
N$69
  Top 0.508: T8.2 64.77,38.86 62.29,36.39 62.29,33.53 63.44,32.38 63.44,31.81 R28.1
  Bottom 0.508: R27.1 66.1,54.48 66.1,48.77 67.25,47.62 67.25,43.81 64.77,41.34 T8.2
N$70
  Bottom 0.508: R24.2 64.2,72.39 70.48,66.1 76.01,66.1 78.68,63.44 WA1.6
N$71
  Bottom 0.508: 57.91,61.53 57.91,50.86 63.44,45.34 63.44,39.43 T8.3 | 57.91,61.53 56.01,63.44 WB1.6 | R29.2 71.63,64.77 70.29,63.44 60.01,63.44 58.1,61.53 57.91,61.53
N$72
  Top 0.508: OK3.3 80.01,53.91 72.96,60.96 67.25,60.96 66.1,62.1 R27.2
N$73
  Top 0.508: R25.2 63.63,34.29 63.63,33.34 65.91,31.05 65.91,24.19 OK4.3
N$74
  Bottom 0.508: T7.3 55.82,40.77 55.82,45.34 53.72,47.43 53.72,64.01 55.82,66.1 WB1.5 56.01,66.1 66.48,66.1 67.82,64.77 R30.2
N$76
  Top 0.508: R30.1 R29.1 73.72,72.58 77.34,76.2 WA1.1
PE
  Top 0.762: SRV2.3 6.29,12.76 5.91,12.76 4.19,14.48 4.19,20.77 6.29,22.86 SRV1.3 | 11.43,47.05 13.91,47.05 T2.1 13.91,46.67 13.91,44.58 15.43,43.05 15.43,40.96 15.24,40.77 T4.1 | 11.43,47.05 7.62,47.05 T1.1 7.81,46.67 7.81,45.53 | 11.43,47.05 R21.2 | T3.1 7.62,41.91 7.81,42.1 7.81,45.53 | VCC+.2 44.39,64.77 44.39,66.67 34.29,76.77 L5V.K 34.1,77.72 32.96,78.87 15.05,78.87 12.95,76.77 12.95,76.39 DC-DC.3 12.57,76.2 12.57,75.82 10.48,73.72 5.14,73.72 WB.2 4.76,73.72 2.86,71.82 2.86,47.24 4.57,45.53 7.81,45.53
  Bottom 0.762: T3.1 7.62,34.86 5.14,32.38 5.14,31.81 R19.2 5.33,31.81 8.57,28.57 8.57,24.77 7.81,24 7.62,24 6.48,22.86 SRV1.3

### Text on the board
tNames: Turnout Decoder V1.2 | Turnout Decoder V1.2 | srv1 | srv1 | srv2 | srv2 | May 2018 | May 2018